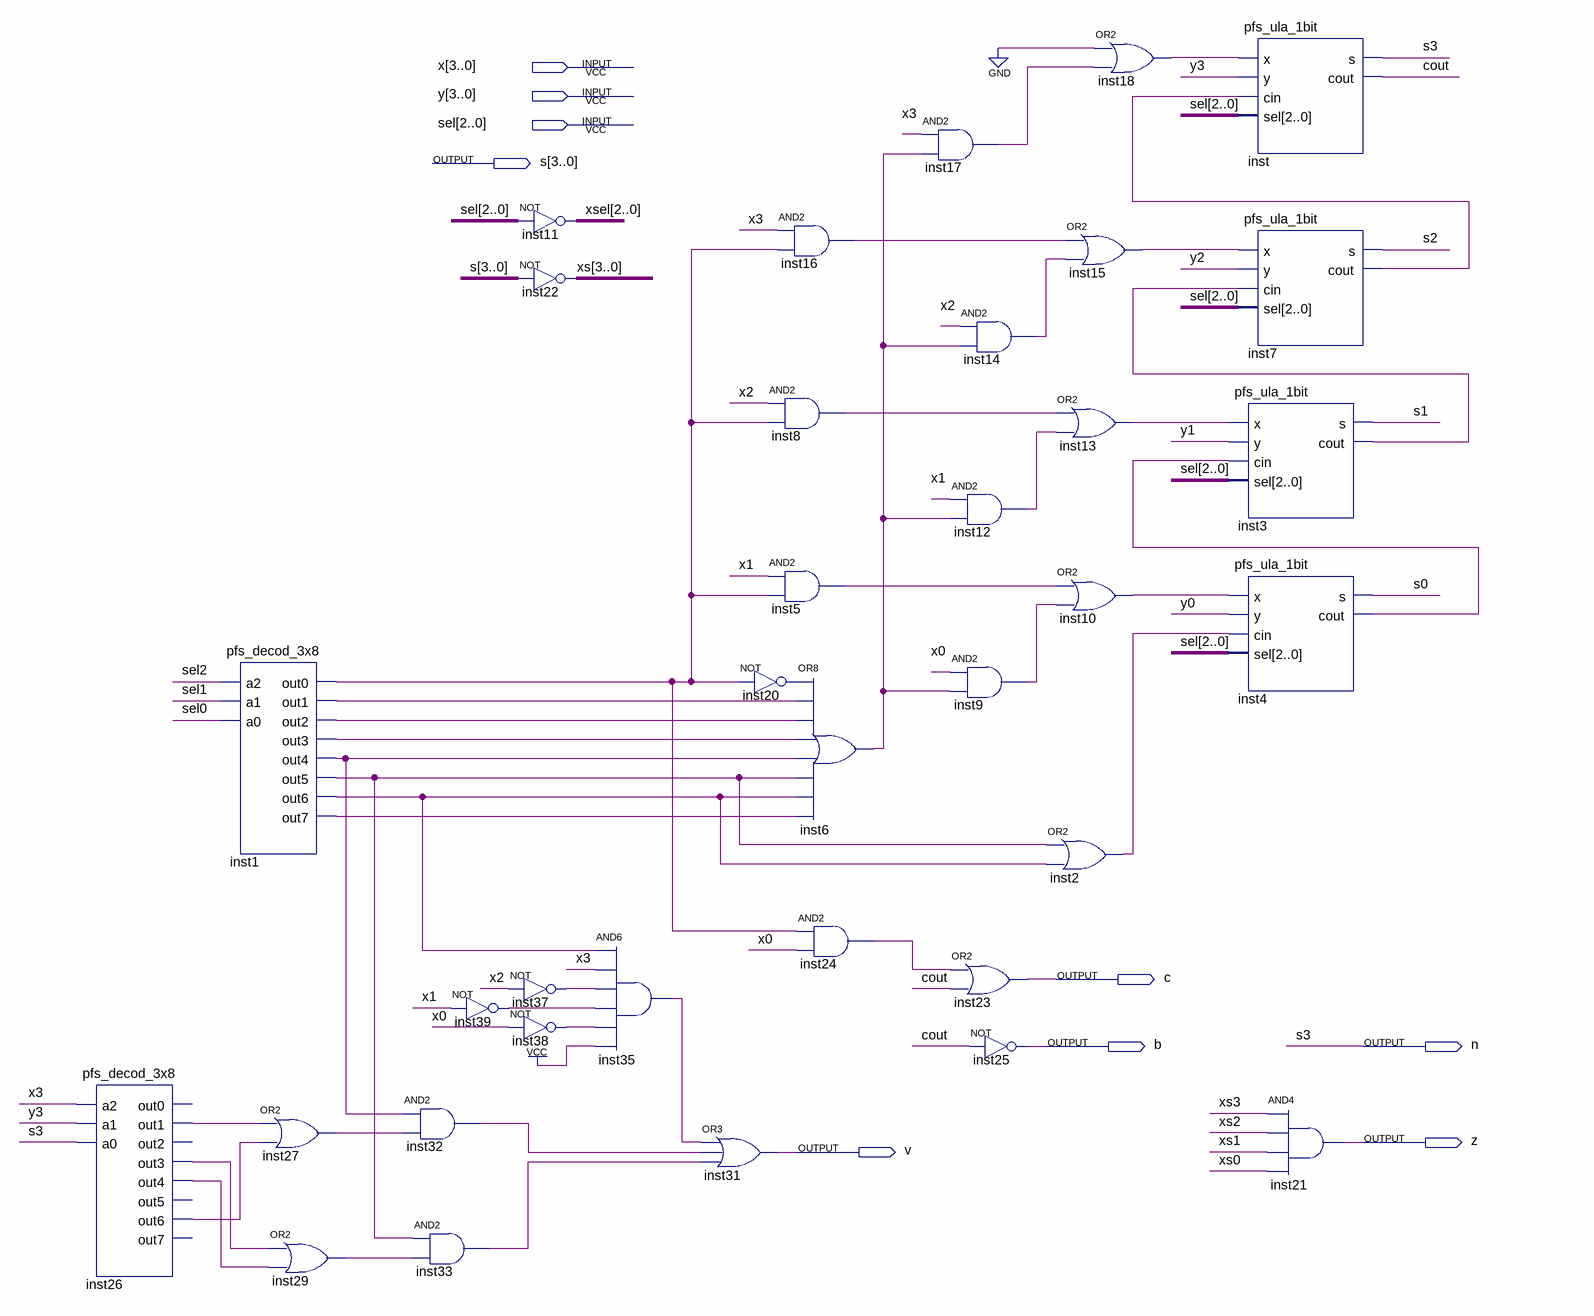
[diagram p0: schematic sheet]
// Quartus schematic pfs_ula_4bits.bdf as structural Verilog: 35 symbols, 9 pins
module pfs_ula_4bits (
  input  [3:0] x,
  input  [3:0] y,
  input  [2:0] sel,
  output [3:0] s,
  output c,
  output b,
  output n,
  output z,
  output v
);

  wire cout, inst1_out0, inst1_out1, inst1_out2, inst1_out3, inst1_out4, inst1_out5, inst1_out6, inst1_out7,
       inst2_out, inst3_cout, inst4_cout, inst5_out, inst6_out, inst7_cout, inst8_out, inst9_out, inst10_out,
       inst12_out, inst13_out, inst14_out, inst15_out, inst16_out, inst17_out, inst18_out, inst20_out,
       inst24_out, inst26_out1, inst26_out3, inst26_out4, inst26_out6, inst27_out, inst29_out, inst32_out,
       inst33_out, inst35_out, inst37_out, inst38_out, inst39_out;
  wire [2:0] xsel;
  wire [3:0] xs;

  pfs_decod_3x8 inst26 (
    .a2(x[3]), .a1(y[3]), .a0(n), .out1(inst26_out1), .out3(inst26_out3), .out4(inst26_out4),
    .out6(inst26_out6));  // open: out0, out2, out5, out7
  pfs_decod_3x8 inst1 (
    .a2(sel[2]), .a1(sel[1]), .a0(sel[0]), .out0(inst1_out0), .out1(inst1_out1), .out2(inst1_out2),
    .out3(inst1_out3), .out4(inst1_out4), .out5(inst1_out5), .out6(inst1_out6), .out7(inst1_out7));
  or inst27 (inst27_out, inst26_out1, inst26_out6);
  or inst29 (inst29_out, inst26_out3, inst26_out4);
  and inst32 (inst32_out, inst1_out4, inst27_out);
  not inst39 (inst39_out, x[1]);
  and inst33 (inst33_out, inst1_out5, inst29_out);
  assign xsel = ~sel;  // NOT inst11, 3 bits wide
  assign xs = ~{n, s[2:0]};  // NOT inst22, 4 bits wide
  not inst37 (inst37_out, x[2]);
  not inst38 (inst38_out, x[0]);
  and inst35 (inst35_out, inst1_out6, x[3], inst37_out, inst39_out, inst38_out, 1'b1);
  or inst31 (v, inst35_out, inst32_out, inst33_out);
  and inst16 (inst16_out, x[3], inst1_out0);
  and inst8 (inst8_out, x[2], inst1_out0);
  and inst5 (inst5_out, x[1], inst1_out0);
  not inst20 (inst20_out, inst1_out0);
  or inst6 (inst6_out, inst20_out, inst1_out1, inst1_out2, inst1_out3, inst1_out4, inst1_out5, inst1_out6, inst1_out7);
  and inst24 (inst24_out, inst1_out0, x[0]);
  and inst17 (inst17_out, x[3], inst6_out);
  and inst14 (inst14_out, x[2], inst6_out);
  and inst12 (inst12_out, x[1], inst6_out);
  and inst9 (inst9_out, x[0], inst6_out);
  or inst23 (c, inst24_out, cout);
  not inst25 (b, cout);
  or inst18 (inst18_out, 1'b0, inst17_out);
  or inst15 (inst15_out, inst16_out, inst14_out);
  or inst13 (inst13_out, inst8_out, inst12_out);
  or inst10 (inst10_out, inst5_out, inst9_out);
  or inst2 (inst2_out, inst1_out5, inst1_out6);
  pfs_ula_1bit inst (.x(inst18_out), .y(y[3]), .cin(inst7_cout), .sel(sel), .s(n), .cout(cout));
  pfs_ula_1bit inst7 (.x(inst15_out), .y(y[2]), .cin(inst3_cout), .sel(sel), .s(s[2]), .cout(inst7_cout));
  pfs_ula_1bit inst3 (.x(inst13_out), .y(y[1]), .cin(inst4_cout), .sel(sel), .s(s[1]), .cout(inst3_cout));
  pfs_ula_1bit inst4 (.x(inst10_out), .y(y[0]), .cin(inst2_out), .sel(sel), .s(s[0]), .cout(inst4_cout));
  and inst21 (z, xs[3], xs[2], xs[1], xs[0]);

  assign s[3] = n;

  // Other names for the same wires on the sheet: s3 = n
endmodule
